# Altium schematic sheet Sheet_1_2021-10-25.schdoc
size 252 x 132 mm
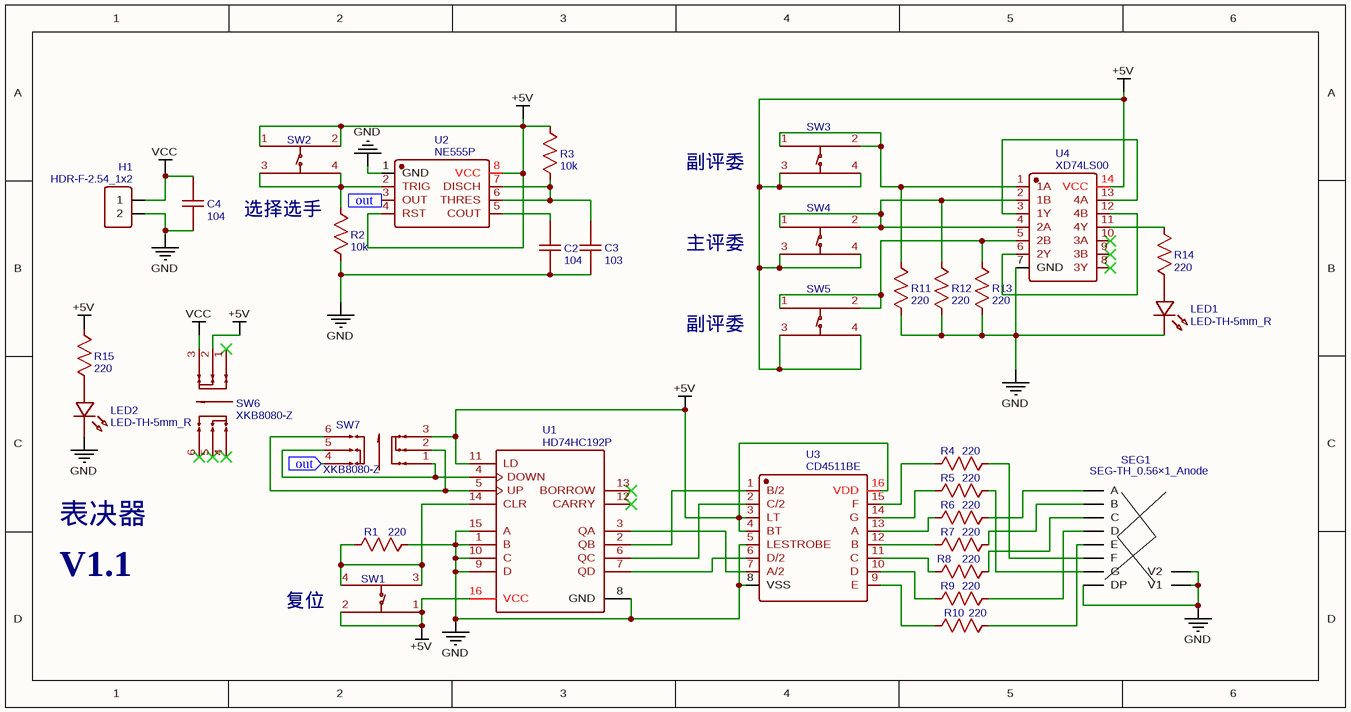
[diagram p0: Sheet_1_2021-10-25.schdoc]

## Parts
C2  104  [RAD-0.2]
C3  103  [RAD-0.2]
C4  104  [RAD-0.2]
H1  HDR-F-2.54_1x2  [HDR-F-2.54_1X2]
LED1  LED-TH-5mm_R  [LED-TH_BD5.0_RED]
LED2  LED-TH-5mm_R  [LED-TH_BD5.0_RED]
R1  220  [R_AXIAL-0.4]
R2  10k  [R_AXIAL-0.4]
R3  10k  [R_AXIAL-0.4]
R4  220  [R_AXIAL-0.4]
R5  220  [R_AXIAL-0.4]
R6  220  [R_AXIAL-0.4]
R7  220  [R_AXIAL-0.4]
R8  220  [R_AXIAL-0.4]
R9  220  [R_AXIAL-0.4]
R10  220  [R_AXIAL-0.4]
R11  220  [R_AXIAL-0.4]
R12  220  [R_AXIAL-0.4]
R13  220  [R_AXIAL-0.4]
R14  220  [R_AXIAL-0.4]
R15  220  [R_AXIAL-0.4]
SEG1  SEG-TH_0.56×1_Anode  [LED-SEG-TH_10P-L12.6-W19.0-P2.54-S15.24-BL]
SW1  复位  [SW-TH_4P-L6.0-W6.0-P4.50-LS6.5]
SW2  选择选手  [SW-TH_4P-L6.0-W6.0-P4.50-LS6.5]
SW3  副评委  [SW-TH_4P-L6.0-W6.0-P4.50-LS6.5]
SW4  主评委  [SW-TH_4P-L6.0-W6.0-P4.50-LS6.5]
SW5  副评委  [SW-TH_4P-L6.0-W6.0-P4.50-LS6.5]
SW6  XKB8080-Z  [SW-TH_6P-L8.0-W8.0-P2.50]
SW7  XKB8080-Z  [SW-TH_6P-L8.0-W8.0-P2.50]
U1  HD74HC192P  [DIP16]
U2  NE555P  [DIP-8_L9.8-W6.6-P2.54-LS7.6-BL]
U3  CD4511BE  [DIP-16_L19.8-W6.5-P2.54-LS7.6-BL]
U4  XD74LS00  [DIP-14_L20.0-W7.6-P2.54-LS7.6-BL]

## Ports
out (in)

## Nets
+5V: R3.1 R15.2 SW1.1(A) SW1.2(B) SW2.1(A) SW2.2(B) SW3.3(C) SW3.4(D) SW4.3(C) SW4.4(D) SW5.3(C) SW5.4(D) SW6.2 SW7.3 U1.11(LD) U1.16(VCC) U2.4(RST) U2.8(VCC) U3.3(LT) U3.4(BT) U3.16(VDD) U4.14(VCC)
GND: C2.1 C3.1 C4.1 H1.2 LED1.2 LED2.2 R1.2 R2.1 R11.1 R12.1 R13.1 SEG1.3(V1) SEG1.5(DP) SEG1.8(V2) U1.1(B) U1.8(GND) U1.9(D) U1.10(C) U1.15(A) U2.1(GND) U3.5(LESTROBE) U3.8(VSS) U4.7(GND)
VCC: C4.2 H1.1 SW6.3
out: SW7.4 U2.3(OUT) ; port out
NetC2_2: C2.2 U2.5(COUT)
NetC3_2: C3.2 R3.2 U2.6(THRES) U2.7(DISCH)
NetLED1_1: LED1.1 R14.1
NetLED2_1: LED2.1 R15.1
NetR1_1: R1.1 SW1.3(C) SW1.4(D) U1.14(CLR)
NetR2_2: R2.2 SW2.3(C) SW2.4(D) U2.2(TRIG)
NetR4_1: R4.1 U3.15(F)
NetR4_2: R4.2 SEG1.9(F)
NetR5_1: R5.1 U3.14(G)
NetR5_2: R5.2 SEG1.10(G)
NetR6_1: R6.1 U3.13(A)
NetR6_2: R6.2 SEG1.7(A)
NetR7_1: R7.1 U3.12(B)
NetR7_2: R7.2 SEG1.6(B)
NetR8_1: R8.1 U3.11(C)
NetR8_2: R8.2 SEG1.4(C)
NetR9_1: R9.1 U3.10(D)
NetR9_2: R9.2 SEG1.2(D)
NetR10_1: R10.1 U3.9(E)
NetR10_2: R10.2 SEG1.1(E)
NetR11_2: R11.2 SW3.1(A) SW3.2(B) U4.1(1A)
NetR12_2: R12.2 SW4.1(A) SW4.2(B) U4.2(1B) U4.4(2A)
NetR13_2: R13.2 SW5.1(A) SW5.2(B) U4.5(2B)
NetR14_2: R14.2 U4.11(4Y)
NetSW7_1: SW7.1 SW7.5 U1.4(DOWN)
NetSW7_2: SW7.2 SW7.6 U1.5(UP)
NetU1_2: U1.2(QB) U3.1(B/2)
NetU1_3: U1.3(QA) U3.7(A/2)
NetU1_6: U1.6(QC) U3.2(C/2)
NetU1_7: U1.7(QD) U3.6(D/2)
NetU4_3: U4.3(1Y) U4.13(4A)
NetU4_6: U4.6(2Y) U4.12(4B)

Not connected (* = marked no-connect by the designer): SW6 1* 4* 5* 6*; U1 12(CARRY)* 13(BORROW)*; U4 8(3Y)* 9(3B)* 10(3A)*

## Notes on the sheet
- 表决器
- V1.1

## Library data of the parts
C2 = 104: nameAlias: Value(F); Contributor: LCEDA_Lib; spicePre: C; spiceSymbolName: C_RAD-0.2_US
C3 C4 = 103: nameAlias: Value(F); Contributor: LCEDA_Lib; spicePre: C; spiceSymbolName: C_RAD-0.2_US
H1 = HDR-F-2.54_1x2: Contributor: LCEDA_Lib; BOM_Supplier Part: C49661; BOM_Supplier: LCSC; spicePre: H; spiceSymbolName: HDR-F-2.54_1x2
LED1 LED2 = LED-TH-5mm_R: BOM_Manufacturer: EVERLIGHT(台湾亿光); BOM_Manufacturer Part: 333-2SURD/S530-A3; Contributor: LCEDA_Lib; BOM_Supplier Part: C87271; BOM_Supplier: LCSC; spicePre: L; spiceSymbolName: LED-TH-5mm_R
R1 R4-R14 = 220: nameAlias: Value(Ω); Contributor: LCEDA_Lib; spicePre: R; spiceSymbolName: R_AXIAL-0.4_US
R2 R3 = 10k: nameAlias: Value(Ω); Contributor: LCEDA_Lib; spicePre: R; spiceSymbolName: R_AXIAL-0.4_US
R15 = 1k: nameAlias: Value(Ω); Contributor: LCEDA_Lib; spicePre: R; spiceSymbolName: R_AXIAL-0.4_US
SEG1 = SEG-TH_0.56×1_Anode: BOM_Manufacturer: 志浩; Contributor: LCEDA_01; BOM_Supplier Part: C8092; BOM_Supplier: LCSC; spicePre: S; spiceSymbolName: SEG-TH_0.56×1_Anode
SW1 = 复位: BOM_Manufacturer: SHOU HAN; BOM_Manufacturer Part: TS665CJ; Contributor: LCSC; BOM_Supplier: LCSC; BOM_Supplier Part: C393938; BOM_JLCPCB Part Class: Extended Part; spicePre: S; spiceSymbolName: TS665CJ
SW2 = 选择选手: BOM_Manufacturer: SHOU HAN; BOM_Manufacturer Part: TS665CJ; Contributor: LCSC; BOM_Supplier: LCSC; BOM_Supplier Part: C393938; BOM_JLCPCB Part Class: Extended Part; spicePre: S; spiceSymbolName: TS665CJ
SW3 SW5 = 副评委: BOM_Manufacturer: SHOU HAN; BOM_Manufacturer Part: TS665CJ; Contributor: LCSC; BOM_Supplier: LCSC; BOM_Supplier Part: C393938; BOM_JLCPCB Part Class: Extended Part; spicePre: S; spiceSymbolName: TS665CJ
SW4 = 主评委: BOM_Manufacturer: SHOU HAN; BOM_Manufacturer Part: TS665CJ; Contributor: LCSC; BOM_Supplier: LCSC; BOM_Supplier Part: C393938; BOM_JLCPCB Part Class: Extended Part; spicePre: S; spiceSymbolName: TS665CJ
SW6 SW7 = XKB8080-Z: BOM_Manufacturer: XKB Enterprise; Contributor: LCSC; BOM_Supplier: LCSC; BOM_Supplier Part: C318860; BOM_Manufacturer Part: XKB8080-Z; BOM_JLCPCB Part Class: Extended Part; spicePre: S; spiceSymbolName: XKB8080-Z
U2 = NE555P: BOM_Manufacturer: TI; BOM_Supplier: LCSC; BOM_Manufacturer Part: NE555P; BOM_Supplier Part: C46749; BOM_JLCPCB Part Class: Extended Part; spicePre: U; spiceSymbolName: NE555P
U3 = CD4511BE: BOM_Manufacturer: TI; spicePre: X; BOM_Supplier: LCSC; BOM_Manufacturer Part: CD4511BE; BOM_Supplier Part: C5327; BOM_JLCPCB Part Class: Extended Part; spiceSymbolName: CD4511BE
U4 = XD74LS00: BOM_Manufacturer: XINLUDA; Contributor: LCSC; BOM_Supplier: LCSC; BOM_Supplier Part: C556265; BOM_Manufacturer Part: XD74LS00; BOM_JLCPCB Part Class: Extended Part; spicePre: U; spiceSymbolName: XD74LS00
U1 = HD74HC192P: spicePre: U; spiceSymbolName: HD74HC192P